# Altium project stm32f405rgt.PrjPcb
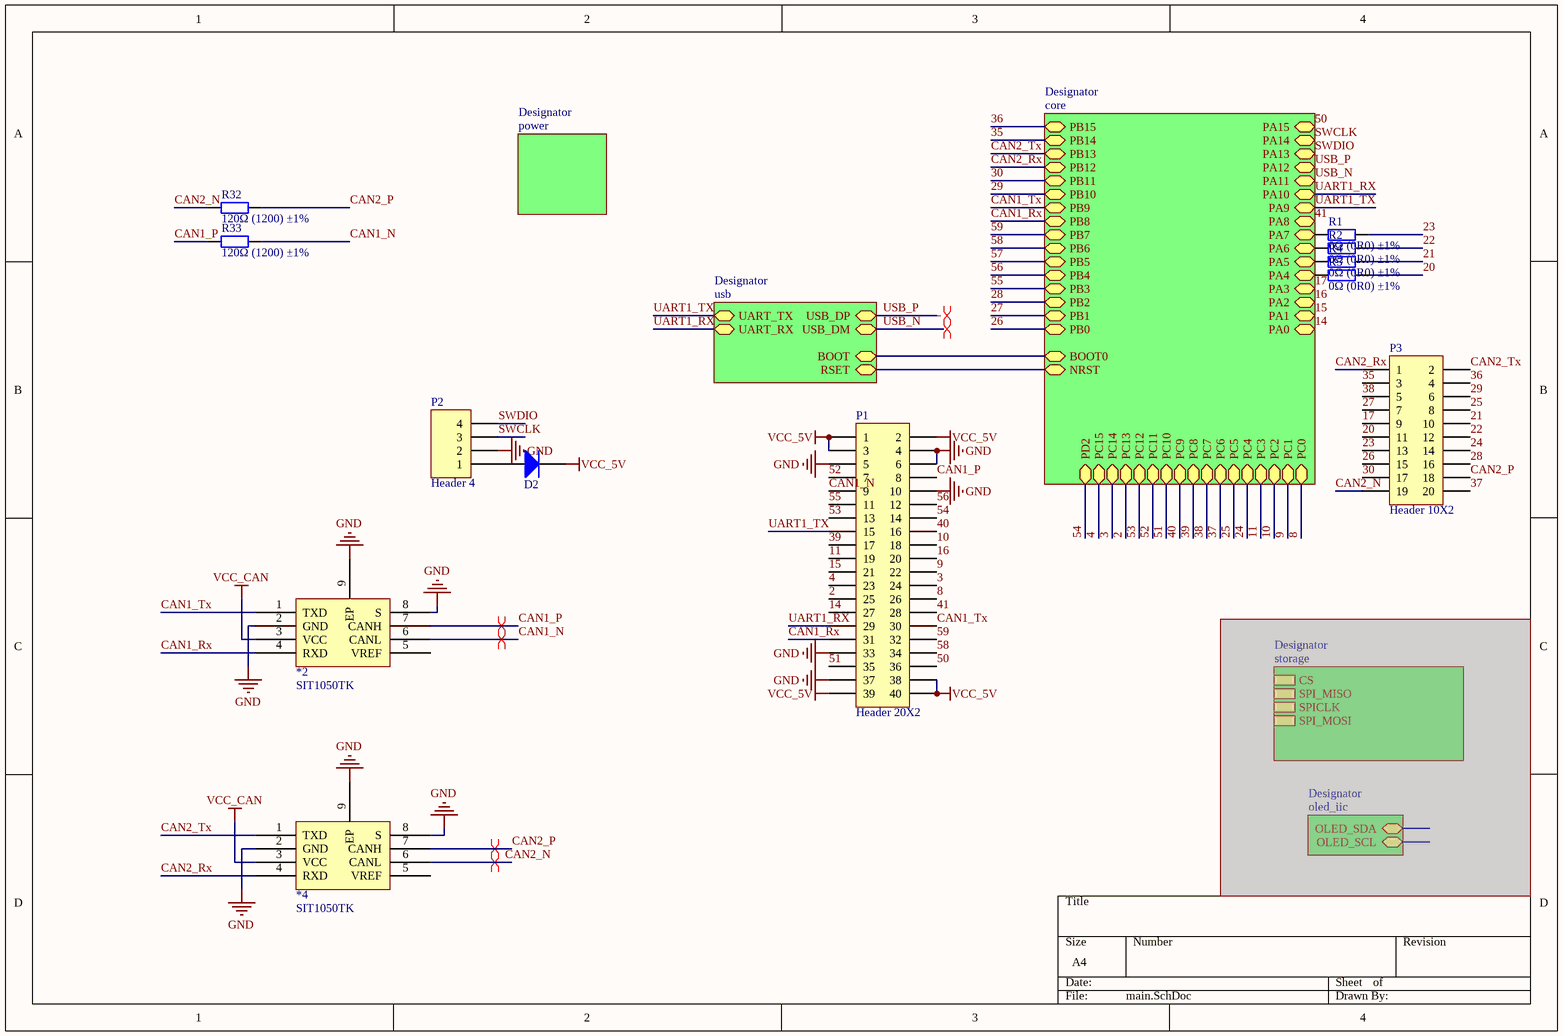
[diagram p0: main.SchDoc]
4 sheets, 89 parts. Net scope: hierarchical (ports join the sheet entries above them; power ports are global).
Board file: PCB1.PcbDoc
Sheets:
  main.SchDoc
    Designator = core.SchDoc
    Designator = usb.SchDoc
    Designator = power.SchDoc

## Sheet main.SchDoc
size A4; SheetNumber: 1; SheetTotal: 4

### Parts
(Parts that share a designator on the sheet are numbered #1, #2 ... from top to bottom, then left to right.)
*2  SIT1050TK  [DFN3x3-8]
*4  SIT1050TK  [DFN3x3-8]
D2#1  二极管-5819W  [SOD-323]  (value not drawn)
P1  Header 20X2  [HEADER_0.8mm_2x20P_G]
P2  Header 4  [HDR1X4]
P3  Header 10X2  [HEAER_0.8mm_2x10P_M]
R1  0Ω (0R0) ±1%  [LC-0402_R]
R2#1  0Ω (0R0) ±1%  [LC-0402_R]
R4#1  0Ω (0R0) ±1%  [LC-0402_R]
R5  0Ω (0R0) ±1%  [LC-0402_R]
R32#1  120Ω (1200) ±1%  [LC-0402_R]
R33#1  120Ω (1200) ±1%  [LC-0402_R]

### Sub-sheets
Designator = core: PB15 (bidir), PB14 (bidir), PB13 (bidir), PB12 (bidir), PB11 (bidir), PB10 (bidir), PB9 (bidir), PB8 (bidir), PB7 (bidir), PB6 (bidir), PB5 (bidir), PB4 (bidir), PB3 (bidir), PB2 (bidir), PB1 (bidir), PB0 (bidir), PA15 (bidir), PA14 (bidir), PA13 (bidir), PA12 (bidir), PA11 (bidir), PA10 (bidir), PA9 (bidir), PA8 (bidir), PA7 (bidir), PA6 (bidir), PA5 (bidir), PA4 (bidir), PA3 (bidir), PA2 (bidir), PA1 (bidir), PA0 (bidir), PD2 (bidir), PC15 (bidir), PC14 (bidir), PC13 (bidir), PC12 (bidir), PC11 (bidir), PC10 (bidir), PC9 (bidir), PC8 (bidir), PC7 (bidir), PC6 (bidir), PC5 (bidir), PC4 (bidir), PC3 (bidir), PC2 (bidir), PC1 (bidir), PC0 (bidir), BOOT0 (bidir), NRST (bidir)
Designator = storage (masked out) (file not in this document): CS, SPI_MISO, SPICLK, SPI_MOSI
Designator = usb: UART_TX (bidir), UART_RX (bidir), USB_DP (bidir), USB_DM (bidir), BOOT (bidir), RSET (bidir)
Designator = power: no entries
Designator = oled_iic (masked out) (file not in this document): OLED_SDA (bidir), OLED_SCL (bidir)

### Nets
GND: *2.2(GND) *2.8(S) *2.9(EP) *4.2(GND) *4.8(S) *4.9(EP) P1.4 P1.5 P1.6 P1.10 P1.33 P1.37 P2.2
VCC_5V: D2#1.2(K) P1.1 P1.2 P1.3 P1.38 P1.39 P1.40
VCC_CAN: *2.3(VCC) *4.3(VCC)
2: P1.25 ; sheet Designator/PC13
3: P1.24 ; sheet Designator/PC14
4: P1.23 ; sheet Designator/PC15
8: P1.26 ; sheet Designator/PC0
9: P1.22 ; sheet Designator/PC1
10: P1.18 ; sheet Designator/PC2
11: P1.19 ; sheet Designator/PC3
14: P1.27 ; sheet Designator/PA0
15: P1.21 ; sheet Designator/PA1
16: P1.20 ; sheet Designator/PA2
17: P3.9 ; sheet Designator/PA3
20: P3.11 R5.2
21: P3.10 R4#1.2
22: P3.12 R2#1.2
23: P3.13 R1.2
24: P3.14 ; sheet Designator/PC4
25: P3.8 ; sheet Designator/PC5
26: P3.15 ; sheet Designator/PB0
27: P3.7 ; sheet Designator/PB1
28: P3.16 ; sheet Designator/PB2
29: P3.6 ; sheet Designator/PB10
30: P3.17 ; sheet Designator/PB11
35: P3.3 ; sheet Designator/PB14
36: P3.4 ; sheet Designator/PB15
37: P3.20 ; sheet Designator/PC6
38: P3.5 ; sheet Designator/PC7
39: P1.17 ; sheet Designator/PC8
40: P1.16 ; sheet Designator/PC9
41: P1.28 ; sheet Designator/PA8
50: P1.36 ; sheet Designator/PA15
51: P1.35 ; sheet Designator/PC10
52: P1.7 ; sheet Designator/PC11
53: P1.13 ; sheet Designator/PC12
54: P1.14 ; sheet Designator/PD2
55: P1.11 ; sheet Designator/PB3
56: P1.12 ; sheet Designator/PB4
58: P1.34 ; sheet Designator/PB6
59: P1.32 ; sheet Designator/PB7
BOOT0: sheet Designator/BOOT0, sheet Designator/BOOT
CAN1_N: *2.6(CANL) P1.9 R33#1.2
CAN1_P: *2.7(CANH) P1.8 R33#1.1
CAN1_Rx: *2.4(RXD) P1.31 ; sheet Designator/PB8
CAN1_Tx: *2.1(TXD) P1.30 ; sheet Designator/PB9
CAN2_N: *4.6(CANL) P3.19 R32#1.1
CAN2_P: *4.7(CANH) P3.18 R32#1.2
CAN2_Rx: *4.4(RXD) P3.1 ; sheet Designator/PB12
CAN2_Tx: *4.1(TXD) P3.2 ; sheet Designator/PB13
SPI_CS: R5.1 ; sheet Designator/PA4
SPI_MISO: R2#1.1 ; sheet Designator/PA6
SPI_MOSI: R1.1 ; sheet Designator/PA7
SPI_SCLK: R4#1.1 ; sheet Designator/PA5
SWCLK: P2.3 ; sheet Designator/PA14
SWDIO: P2.4 ; sheet Designator/PA13
UART1_RX: P1.29 ; sheet Designator/PA10, sheet Designator/UART_RX
UART1_TX: P1.15 ; sheet Designator/PA9, sheet Designator/UART_TX
USB_N: sheet Designator/PA11, sheet Designator/USB_DM
USB_P: sheet Designator/PA12, sheet Designator/USB_DP
Net*_4: sheet Designator/NRST, sheet Designator/RSET
NetD2#1_1: D2#1.1(A) P2.1

Not connected (* = marked no-connect by the designer): *2 5(VREF); *4 5(VREF)

### Layout directives
differential pair: CAN1_N, CAN1_P, CAN2_N, CAN2_P, USB_N, USB_P

### Library data of the parts
D2#1 = 二极管-5819W: 40V
P1 = Header 20X2: Header, 20-Pin, Dual row; LatestRevisionDate: 17-Jul-2002; LatestRevisionNote: Re-released for DXP Platform.; Publisher: Altium Limited
P2 = Header 4: Header, 4-Pin; LatestRevisionDate: 17-Jul-2002; LatestRevisionNote: Re-released for DXP Platform.; Publisher: Altium Limited
P3 = Header 10X2: Header, 10-Pin, Dual row; LatestRevisionDate: 17-Jul-2002; LatestRevisionNote: Re-released for DXP Platform.; Publisher: Altium Limited
R1 R2#1 R4#1 R5 = 0402 0Ω (0R0) 1%: 贴片电阻; ComponentLink1Description: 供应商链接; ComponentLink1URL: http://www.szlcsc.com/product/details_17853.html; Package: 0402; Supplier: LC; SuppliersPartNumber: C17168
R32#1 R33#1 = 0402 120Ω (1200) 1%: 贴片电阻; ComponentLink1Description: 供应商链接; ComponentLink1URL: http://www.szlcsc.com/product/details_25822.html; Package: 0402; Supplier: LC; SuppliersPartNumber: C25079

## Sheet core.SchDoc
size A4; SheetNumber: 3; SheetTotal: 5
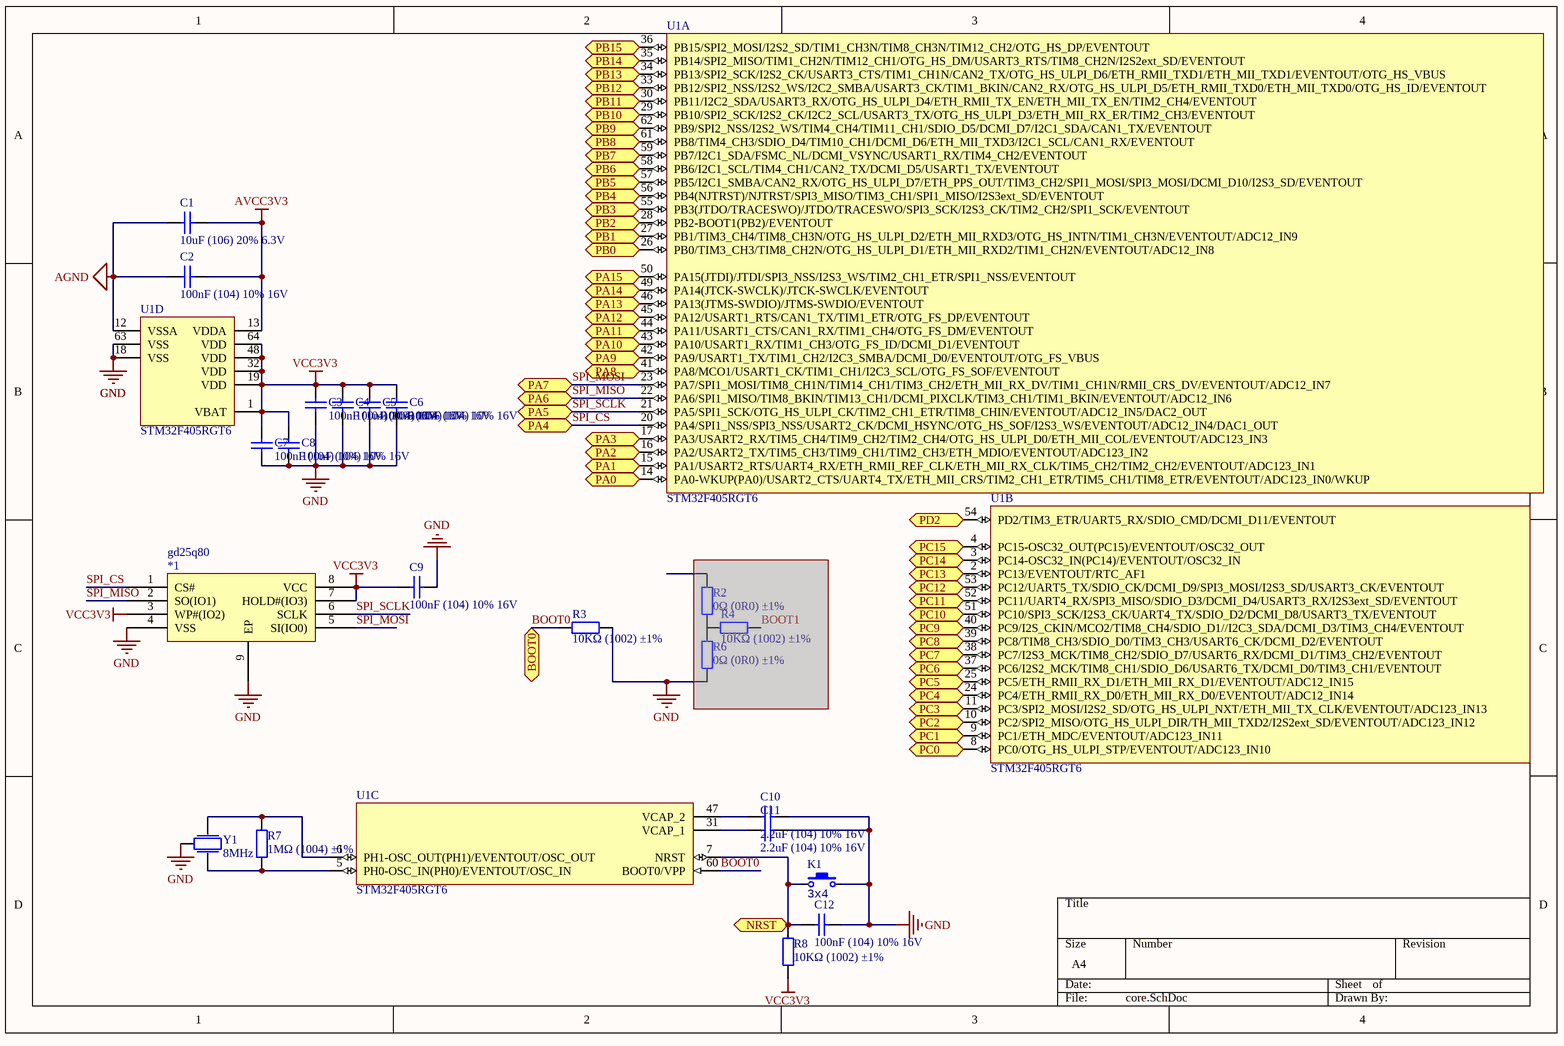
[diagram p1: core.SchDoc]

### Parts
(Parts that share a designator on the sheet are numbered #1, #2 ... from top to bottom, then left to right.)
*1  gd25q80  [USON-8]
C1  10uF (106) 20% 6.3V  [LC-0402_C]
C2  100nF (104) 10% 16V  [LC-0402_C]
C3  100nF (104) 10% 16V  [LC-0402_C]
C4  100nF (104) 10% 16V  [LC-0402_C]
C5  100nF (104) 10% 16V  [LC-0402_C]
C6  100nF (104) 10% 16V  [LC-0402_C]
C7  100nF (104) 10% 16V  [LC-0402_C]
C8  100nF (104) 10% 16V  [LC-0402_C]
C9  100nF (104) 10% 16V  [LC-0402_C]
C10  2.2uF (104) 10% 16V  [LC-0402_C]
C11  2.2uF (104) 10% 16V  [LC-0402_C]
C12  100nF (104) 10% 16V  [LC-0402_C]
K1  value 3x4  [ButtonTACT_3x4x2_180]  (hidden comment: TACT 2P)
R2#2  0Ω (0R0) ±1%  [LC-0402_R]  (masked out: inside a compile mask, not in the netlist)
R3  10KΩ (1002) ±1%  [LC-0402_R]
R4#2  10KΩ (1002) ±1%  [LC-0402_R]  (masked out: inside a compile mask, not in the netlist)
R6#1  0Ω (0R0) ±1%  [LC-0402_R]  (masked out: inside a compile mask, not in the netlist)
R7  1MΩ (1004) ±1%  [LC-0402_R]
R8  10KΩ (1002) ±1%  [LC-0402_R]
U1  STM32F405RGT6  [LC-LQFP-64_10x10x05P]  (parts A,B,C,D of 4)
Y1  8MHz  [晶振-3P]

### Ports
BOOT0 (bidir), NRST (bidir), PA0 (bidir), PA1 (bidir), PA2 (bidir), PA3 (bidir), PA4 (bidir), PA5 (bidir), PA6 (bidir), PA7 (bidir), PA8 (bidir), PA9 (bidir), PA10 (bidir), PA11 (bidir), PA12 (bidir), PA13 (bidir), PA14 (bidir), PA15 (bidir), PB0 (bidir), PB1 (bidir), PB2 (bidir), PB3 (bidir), PB4 (bidir), PB5 (bidir), PB6 (bidir), PB7 (bidir), PB8 (bidir), PB9 (bidir), PB10 (bidir), PB11 (bidir), PB12 (bidir), PB13 (bidir), PB14 (bidir), PB15 (bidir), PC0 (bidir), PC1 (bidir), PC2 (bidir), PC3 (bidir), PC4 (bidir), PC5 (bidir), PC6 (bidir), PC7 (bidir), PC8 (bidir), PC9 (bidir), PC10 (bidir), PC11 (bidir), PC12 (bidir), PC13 (bidir), PC14 (bidir), PC15 (bidir), PD2 (bidir)

### Nets
AGND: C1.1 C2.2 U1.12(VSSA)
AVCC3V3: C1.2 C2.1 U1.13(VDDA)
GND: *1.4(VSS) *1.9(EP) C3.1 C4.1 C5.1 C6.1 C7.1 C8.1 C9.1 C10.1 C11.1 C12.1 K1.2 R3.1 U1.18(VSS) U1.63(VSS) Y1.2
VCC3V3: *1.3(WP#(IO2)) *1.7(HOLD#(IO3)) *1.8(VCC) C3.2 C4.2 C5.2 C6.2 C7.2 C8.2 C9.2 R8.1 U1.1(VBAT) U1.19(VDD) U1.32(VDD) U1.48(VDD) U1.64(VDD)
2: U1.2(PC13/EVENTOUT/RTC_AF1) ; port PC13
3: U1.3(PC14-OSC32_IN(PC14)/EVENTOUT/OSC32_IN) ; port PC14
4: U1.4(PC15-OSC32_OUT(PC15)/EVENTOUT/OSC32_OUT) ; port PC15
8: U1.8(PC0/OTG_HS_ULPI_STP/EVENTOUT/ADC123_IN10) ; port PC0
9: U1.9(PC1/ETH_MDC/EVENTOUT/ADC123_IN11) ; port PC1
10: U1.10(PC2/SPI2_MISO/OTG_HS_ULPI_DIR/TH_MII_TXD2/I2S2ext_SD/EVENTOUT/ADC123_IN12) ; port PC2
11: U1.11(PC3/SPI2_MOSI/I2S2_SD/OTG_HS_ULPI_NXT/ETH_MII_TX_CLK/EVENTOUT/ADC123_IN13) ; port PC3
14: U1.14(PA0-WKUP(PA0)/USART2_CTS/UART4_TX/ETH_MII_CRS/TIM2_CH1_ETR/TIM5_CH1/TIM8_ETR/EVENTOUT/ADC123_IN0/WKUP) ; port PA0
15: U1.15(PA1/USART2_RTS/UART4_RX/ETH_RMII_REF_CLK/ETH_MII_RX_CLK/TIM5_CH2/TIM2_CH2/EVENTOUT/ADC123_IN1) ; port PA1
16: U1.16(PA2/USART2_TX/TIM5_CH3/TIM9_CH1/TIM2_CH3/ETH_MDIO/EVENTOUT/ADC123_IN2) ; port PA2
17: U1.17(PA3/USART2_RX/TIM5_CH4/TIM9_CH2/TIM2_CH4/OTG_HS_ULPI_D0/ETH_MII_COL/EVENTOUT/ADC123_IN3) ; port PA3
24: U1.24(PC4/ETH_RMII_RX_D0/ETH_MII_RX_D0/EVENTOUT/ADC12_IN14) ; port PC4
25: U1.25(PC5/ETH_RMII_RX_D1/ETH_MII_RX_D1/EVENTOUT/ADC12_IN15) ; port PC5
26: U1.26(PB0/TIM3_CH3/TIM8_CH2N/OTG_HS_ULPI_D1/ETH_MII_RXD2/TIM1_CH2N/EVENTOUT/ADC12_IN8) ; port PB0
27: U1.27(PB1/TIM3_CH4/TIM8_CH3N/OTG_HS_ULPI_D2/ETH_MII_RXD3/OTG_HS_INTN/TIM1_CH3N/EVENTOUT/ADC12_IN9) ; port PB1
28: U1.28(PB2-BOOT1(PB2)/EVENTOUT) ; port PB2
29: U1.29(PB10/SPI2_SCK/I2S2_CK/I2C2_SCL/USART3_TX/OTG_HS_ULPI_D3/ETH_MII_RX_ER/TIM2_CH3/EVENTOUT) ; port PB10
30: U1.30(PB11/I2C2_SDA/USART3_RX/OTG_HS_ULPI_D4/ETH_RMII_TX_EN/ETH_MII_TX_EN/TIM2_CH4/EVENTOUT) ; port PB11
35: U1.35(PB14/SPI2_MISO/TIM1_CH2N/TIM12_CH1/OTG_HS_DM/USART3_RTS/TIM8_CH2N/I2S2ext_SD/EVENTOUT) ; port PB14
36: U1.36(PB15/SPI2_MOSI/I2S2_SD/TIM1_CH3N/TIM8_CH3N/TIM12_CH2/OTG_HS_DP/EVENTOUT) ; port PB15
37: U1.37(PC6/I2S2_MCK/TIM8_CH1/SDIO_D6/USART6_TX/DCMI_D0/TIM3_CH1/EVENTOUT) ; port PC6
38: U1.38(PC7/I2S3_MCK/TIM8_CH2/SDIO_D7/USART6_RX/DCMI_D1/TIM3_CH2/EVENTOUT) ; port PC7
39: U1.39(PC8/TIM8_CH3/SDIO_D0/TIM3_CH3/USART6_CK/DCMI_D2/EVENTOUT) ; port PC8
40: U1.40(PC9/I2S_CKIN/MCO2/TIM8_CH4/SDIO_D1//I2C3_SDA/DCMI_D3/TIM3_CH4/EVENTOUT) ; port PC9
41: U1.41(PA8/MCO1/USART1_CK/TIM1_CH1/I2C3_SCL/OTG_FS_SOF/EVENTOUT) ; port PA8
50: U1.50(PA15(JTDI)/JTDI/SPI3_NSS/I2S3_WS/TIM2_CH1_ETR/SPI1_NSS/EVENTOUT) ; port PA15
51: U1.51(PC10/SPI3_SCK/I2S3_CK/UART4_TX/SDIO_D2/DCMI_D8/USART3_TX/EVENTOUT) ; port PC10
52: U1.52(PC11/UART4_RX/SPI3_MISO/SDIO_D3/DCMI_D4/USART3_RX/I2S3ext_SD/EVENTOUT) ; port PC11
53: U1.53(PC12/UART5_TX/SDIO_CK/DCMI_D9/SPI3_MOSI/I2S3_SD/USART3_CK/EVENTOUT) ; port PC12
54: U1.54(PD2/TIM3_ETR/UART5_RX/SDIO_CMD/DCMI_D11/EVENTOUT) ; port PD2
55: U1.55(PB3(JTDO/TRACESWO)/JTDO/TRACESWO/SPI3_SCK/I2S3_CK/TIM2_CH2/SPI1_SCK/EVENTOUT) ; port PB3
56: U1.56(PB4(NJTRST)/NJTRST/SPI3_MISO/TIM3_CH1/SPI1_MISO/I2S3ext_SD/EVENTOUT) ; port PB4
57: U1.57(PB5/I2C1_SMBA/CAN2_RX/OTG_HS_ULPI_D7/ETH_PPS_OUT/TIM3_CH2/SPI1_MOSI/SPI3_MOSI/DCMI_D10/I2S3_SD/EVENTOUT) ; port PB5
58: U1.58(PB6/I2C1_SCL/TIM4_CH1/CAN2_TX/DCMI_D5/USART1_TX/EVENTOUT) ; port PB6
59: U1.59(PB7/I2C1_SDA/FSMC_NL/DCMI_VSYNC/USART1_RX/TIM4_CH2/EVENTOUT) ; port PB7
BOOT0: R3.2 U1.60(BOOT0/VPP) ; port BOOT0
CAN1_Rx: U1.61(PB8/TIM4_CH3/SDIO_D4/TIM10_CH1/DCMI_D6/ETH_MII_TXD3/I2C1_SCL/CAN1_RX/EVENTOUT) ; port PB8
CAN1_Tx: U1.62(PB9/SPI2_NSS/I2S2_WS/TIM4_CH4/TIM11_CH1/SDIO_D5/DCMI_D7/I2C1_SDA/CAN1_TX/EVENTOUT) ; port PB9
CAN2_Rx: U1.33(PB12/SPI2_NSS/I2S2_WS/I2C2_SMBA/USART3_CK/TIM1_BKIN/CAN2_RX/OTG_HS_ULPI_D5/ETH_RMII_TXD0/ETH_MII_TXD0/OTG_HS_ID/EVENTOUT) ; port PB12
CAN2_Tx: U1.34(PB13/SPI2_SCK/I2S2_CK/USART3_CTS/TIM1_CH1N/CAN2_TX/OTG_HS_ULPI_D6/ETH_RMII_TXD1/ETH_MII_TXD1/EVENTOUT/OTG_HS_VBUS) ; port PB13
SPI_CS: *1.1(CS#) U1.20(PA4/SPI1_NSS/SPI3_NSS/USART2_CK/DCMI_HSYNC/OTG_HS_SOF/I2S3_WS/EVENTOUT/ADC12_IN4/DAC1_OUT) ; port PA4
SPI_MISO: *1.2(SO(IO1)) U1.22(PA6/SPI1_MISO/TIM8_BKIN/TIM13_CH1/DCMI_PIXCLK/TIM3_CH1/TIM1_BKIN/EVENTOUT/ADC12_IN6) ; port PA6
SPI_MOSI: *1.5(SI(IO0)) U1.23(PA7/SPI1_MOSI/TIM8_CH1N/TIM14_CH1/TIM3_CH2/ETH_MII_RX_DV/TIM1_CH1N/RMII_CRS_DV/EVENTOUT/ADC12_IN7) ; port PA7
SPI_SCLK: *1.6(SCLK) U1.21(PA5/SPI1_SCK/OTG_HS_ULPI_CK/TIM2_CH1_ETR/TIM8_CHIN/EVENTOUT/ADC12_IN5/DAC2_OUT) ; port PA5
SWCLK: U1.49(PA14(JTCK-SWCLK)/JTCK-SWCLK/EVENTOUT) ; port PA14
SWDIO: U1.46(PA13(JTMS-SWDIO)/JTMS-SWDIO/EVENTOUT) ; port PA13
UART1_RX: U1.43(PA10/USART1_RX/TIM1_CH3/OTG_FS_ID/DCMI_D1/EVENTOUT) ; port PA10
UART1_TX: U1.42(PA9/USART1_TX/TIM1_CH2/I2C3_SMBA/DCMI_D0/EVENTOUT/OTG_FS_VBUS) ; port PA9
USB_N: U1.44(PA11/USART1_CTS/CAN1_RX/TIM1_CH4/OTG_FS_DM/EVENTOUT) ; port PA11
USB_P: U1.45(PA12/USART1_RTS/CAN1_TX/TIM1_ETR/OTG_FS_DP/EVENTOUT) ; port PA12
Net*_4: C12.2 K1.1 R8.2 U1.7(NRST) ; port NRST
NetC10_2: C10.2 U1.47(VCAP_2)
NetC11_2: C11.2 U1.31(VCAP_1)
NetR7_1: R7.1 U1.5(PH0-OSC_IN(PH0)/EVENTOUT/OSC_IN) Y1.1
NetR7_2: R7.2 U1.6(PH1-OSC_OUT(PH1)/EVENTOUT/OSC_OUT) Y1.3

### Library data of the parts
C1 = 0402 10uF (106) 20% 6.3V: 贴片电容; ComponentLink1Description: 供应商链接; ComponentLink1URL: http://www.szlcsc.com/product/details_16204.html; Package: 0402; Supplier: LC; SuppliersPartNumber: C15525
C2-C12 = 0402 100nF (104) 10% 16V: 贴片电容; ComponentLink1Description: 供应商链接; ComponentLink1URL: http://www.szlcsc.com/product/details_1877.html; Package: 0402; Supplier: LC; SuppliersPartNumber: C1525
K1 = ButtonTACT_3x4x2_180: Button; type: TACT 2P
R2#2 R6#1 = 0402 0Ω (0R0) 1%: 贴片电阻; ComponentLink1Description: 供应商链接; ComponentLink1URL: http://www.szlcsc.com/product/details_17853.html; Package: 0402; Supplier: LC; SuppliersPartNumber: C17168
R3 R4#2 R8 = 0402 10KΩ (1002) 1%: 贴片电阻; ComponentLink1Description: 供应商链接; ComponentLink1URL: http://www.szlcsc.com/product/details_26487.html; Package: 0402; Supplier: LC; SuppliersPartNumber: C25744
R7 = 0402 1MΩ (1004) 1%: 贴片电阻; ComponentLink1Description: 供应商链接; ComponentLink1URL: http://www.szlcsc.com/product/details_26826.html; Package: 0402; Supplier: LC; SuppliersPartNumber: C26083
U1 = STM32F405RGT6: ARM; ComponentLink1Description: 供应商链接; ComponentLink1URL: http://www.szlcsc.com/product/details_16424.html; Package: LQFP-64_10x10x05P; Supplier: LC; SuppliersPartNumber: C15742
Y1 = 晶振-3Pin: 村田贴片

## Sheet usb.SchDoc
size A4; SheetNumber: 5; SheetTotal: 5
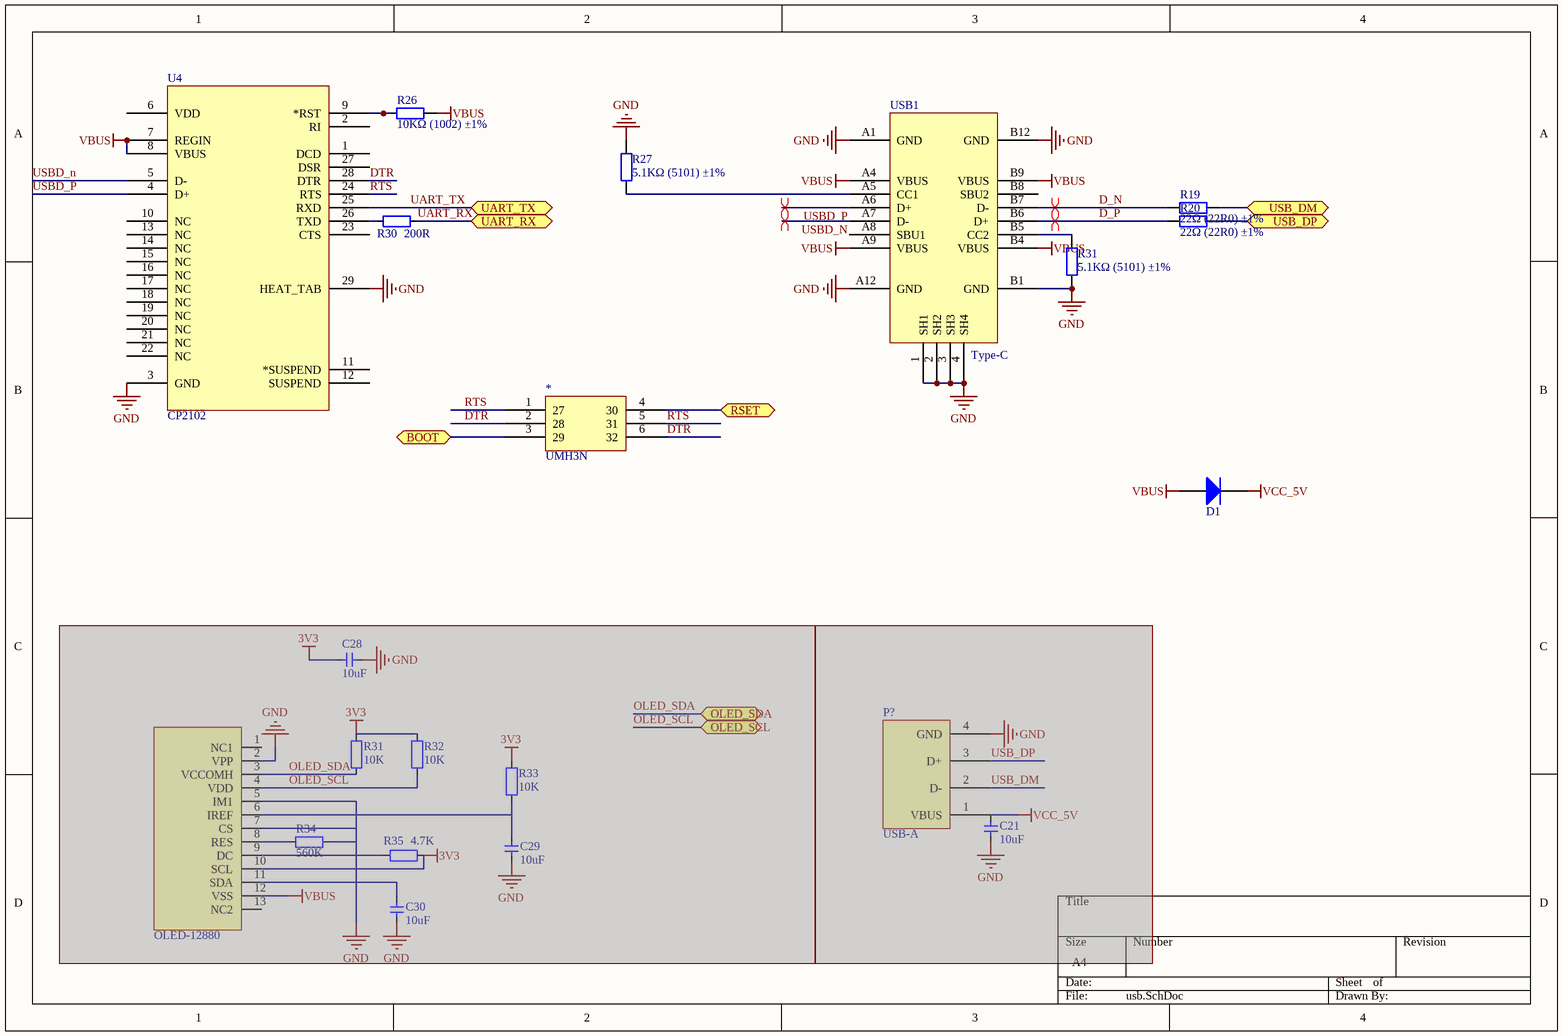
[diagram p2: usb.SchDoc]

### Parts
(Parts that share a designator on the sheet are numbered #1, #2 ... from top to bottom, then left to right.)
2  OLED-12880  [OLED-12880]  (masked out: inside a compile mask, not in the netlist)
*  UMH3N  [SC-70-6(SOT-363)]
C21#1  10uF  [CAP_0402]  (masked out: inside a compile mask, not in the netlist)
C28  10uF  [CAP_0402]  (masked out: inside a compile mask, not in the netlist)
C29  10uF  [CAP_0402]  (masked out: inside a compile mask, not in the netlist)
C30  10uF  [CAP_0402]  (masked out: inside a compile mask, not in the netlist)
D1#1  二极管-5819W  [SOD-323]  (value not drawn)
P?  USB-A  [USB-Short]  (masked out: inside a compile mask, not in the netlist)
R19  22Ω (22R0) ±1%  [LC-0402_R]
R20#1  22Ω (22R0) ±1%  [LC-0402_R]
R26  10KΩ (1002) ±1%  [LC-0402_R]
R27  5.1KΩ (5101) ±1%  [LC-0402_R]
R30  200R  [RES_0402]
R31#1  5.1KΩ (5101) ±1%  [LC-0402_R]
R31#2  10K  [RES_0402]  (masked out: inside a compile mask, not in the netlist)
R32#2  10K  [RES_0402]  (masked out: inside a compile mask, not in the netlist)
R33#2  10K  [RES_0402]  (masked out: inside a compile mask, not in the netlist)
R34  560K  [RES_0402]  (masked out: inside a compile mask, not in the netlist)
R35  4.7K  [RES_0402]  (masked out: inside a compile mask, not in the netlist)
U4  CP2102  [QFN-28]
USB1  Type-C  [Type-C-TOP]

### Ports
BOOT (bidir), OLED_SCL (bidir), OLED_SDA (bidir), RSET (bidir), UART_RX (bidir), UART_TX (bidir), USB_DM (bidir), USB_DP (bidir)

### Nets
GND: R27.1 R31#1.1 U4.3(GND) U4.29(HEAT_TAB) USB1.1(SH1) USB1.2(SH2) USB1.3(SH3) USB1.4(SH4) USB1.A1(GND) USB1.A12(GND) USB1.B1(GND) USB1.B12(GND)
VBUS: D1#1.1(A) R26.2 U4.7(REGIN) U4.8(VBUS) USB1.A4(VBUS) USB1.A9(VBUS) USB1.B4(VBUS) USB1.B9(VBUS)
VCC_5V: D1#1.2(K)
BOOT0: *.3(29) ; port BOOT
D_N: R19.2 USB1.B7(D-)
D_P: R20#1.2 USB1.B6(D+)
DTR: *.2(28) *.6(32) U4.28(DTR)
RTS: *.1(27) *.5(31) U4.24(RTS)
UART_RX: R30.1 ; port UART_RX  [project net UART1_RX]
UART_TX: U4.25(RXD) ; port UART_TX  [project net UART1_TX]
USB_N: R19.1 ; port USB_DM
USB_P: R20#1.1 ; port USB_DP
USBD_n: U4.5(D-) USB1.A7(D-)
USBD_P: U4.4(D+) USB1.A6(D+)
Net*_4: *.4(30) ; port RSET
NetR26_1: R26.1 U4.9(*RST)
NetR27_2: R27.2 USB1.A5(CC1)
NetR30_2: R30.2 U4.26(TXD)
NetR31#1_2: R31#1.2 USB1.B5(CC2)

Not connected (* = marked no-connect by the designer): U4 1(DCD) 2(RI) 6(VDD) 10(NC) 11(*SUSPEND) 12(SUSPEND) 13(NC) 14(NC) 15(NC) 16(NC) 17(NC) 18(NC) 19(NC) 20(NC) 21(NC) 22(NC) 23(CTS) 27(DSR); USB1 A8(SBU1) B8(SBU2)

### Layout directives
differential pair: D_N, D_P, USBD_n, USBD_P

### Library data of the parts
C21#1 C28-C30 = 电容-0402: Capacitor; Value: 0.1u
D1#1 = 二极管-5819W: 40V
R19 R20#1 = 0402 22Ω (22R0) 1%: 贴片电阻; ComponentLink1Description: 供应商链接; ComponentLink1URL: http://www.szlcsc.com/product/details_25835.html; Package: 0402; Supplier: LC; SuppliersPartNumber: C25092
R26 = 0402 10KΩ (1002) 1%: 贴片电阻; ComponentLink1Description: 供应商链接; ComponentLink1URL: http://www.szlcsc.com/product/details_26487.html; Package: 0402; Supplier: LC; SuppliersPartNumber: C25744
R27 R31#1 = 0402 5.1KΩ (5101) 1%: 贴片电阻; ComponentLink1Description: 供应商链接; ComponentLink1URL: http://www.szlcsc.com/product/details_26648.html; Package: 0402; Supplier: LC; SuppliersPartNumber: C25905
R30 R31#2 R32#2 R33#2 R34 R35 = 电阻-0402: Resistor; Value: 22R
U4 = CP2102: USB转TTL; PART DESC: SINGLE-CHIP USB TO UART BRIDGE, QFN28, RoHS.; MFG #1: SILICON LABS; PART NUMBER: CP2102; Value: Value; RefDes: RefDes; Type: DEV
USB1 = USB-Type-C-TOP

## Sheet power.SchDoc
size A4; SheetNumber: 4; SheetTotal: 5
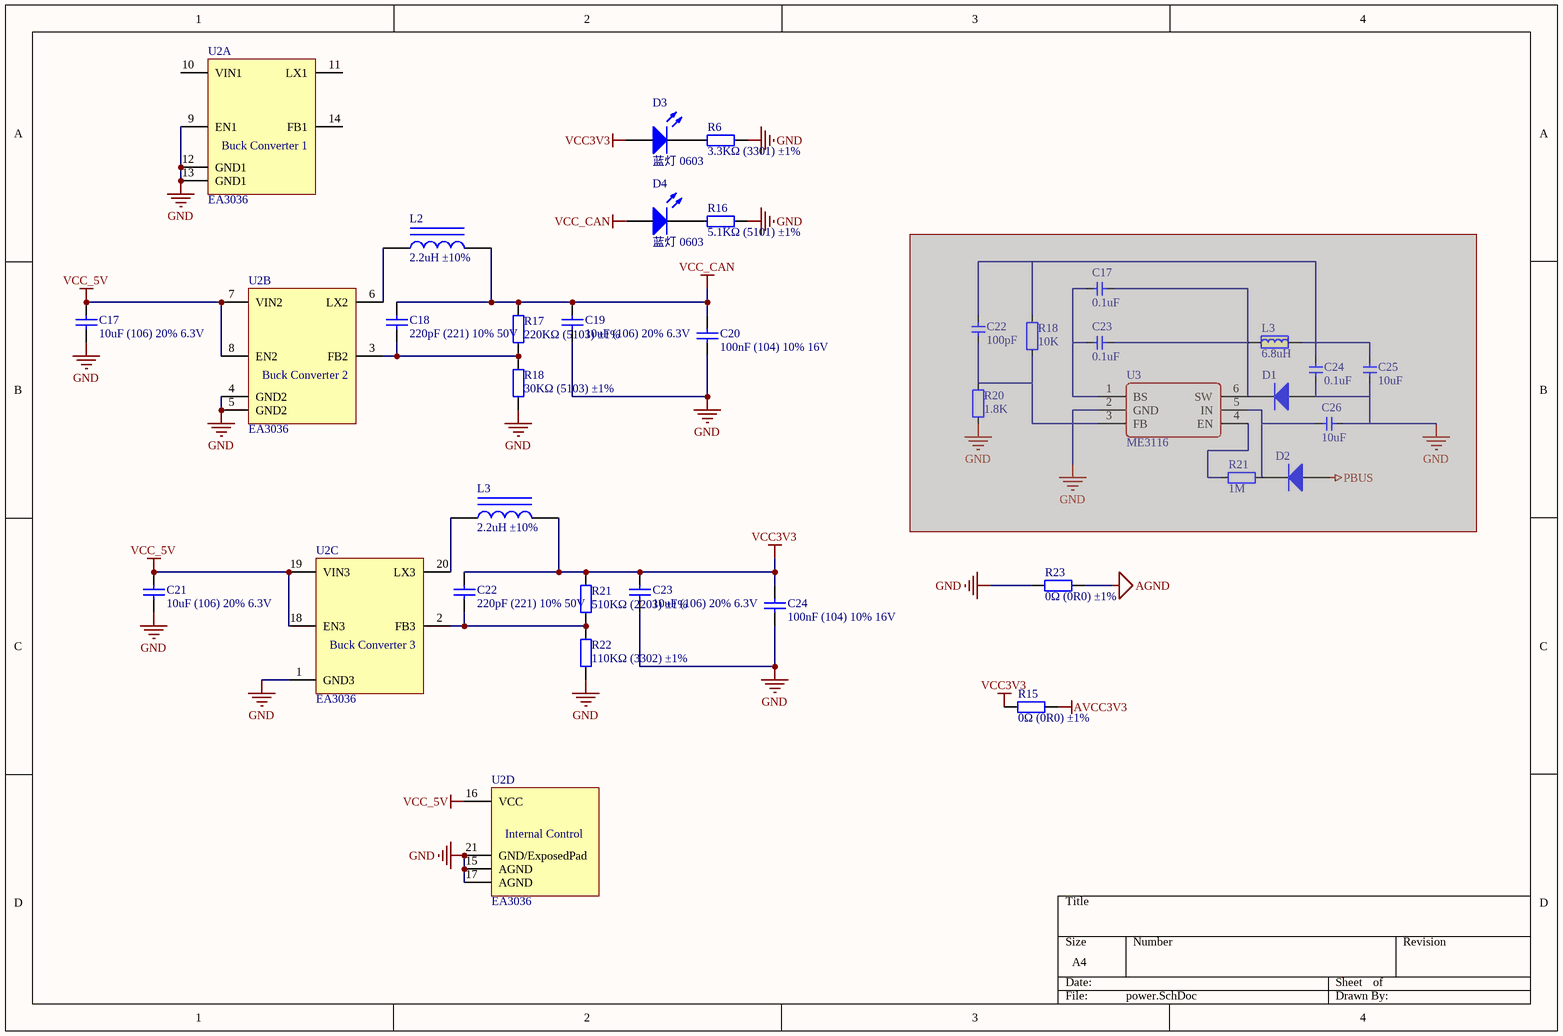
[diagram p3: power.SchDoc]

### Parts
(Parts that share a designator on the sheet are numbered #1, #2 ... from top to bottom, then left to right.)
C17#1  0.1uF  [CAP_0402]  (masked out: inside a compile mask, not in the netlist)
C17#2  10uF (106) 20% 6.3V  [LC-0402_C]
C18  220pF (221) 10% 50V  [LC-0402_C]
C19  10uF (106) 20% 6.3V  [LC-0402_C]
C20  100nF (104) 10% 16V  [LC-0402_C]
C21#2  10uF (106) 20% 6.3V  [LC-0402_C]
C22#1  100pF  [CAP_0402]  (masked out: inside a compile mask, not in the netlist)
C22#2  220pF (221) 10% 50V  [LC-0402_C]
C23#1  0.1uF  [CAP_0402]  (masked out: inside a compile mask, not in the netlist)
C23#2  10uF (106) 20% 6.3V  [LC-0402_C]
C24#1  0.1uF  [CAP_0402]  (masked out: inside a compile mask, not in the netlist)
C24#2  100nF (104) 10% 16V  [LC-0402_C]
C25  10uF  [CAP_0402]  (masked out: inside a compile mask, not in the netlist)
C26  10uF  [CAP_0402]  (masked out: inside a compile mask, not in the netlist)
D1#2  二极管-5B5819WS  [SOD-323]  (value not drawn)  (masked out: inside a compile mask, not in the netlist)
D2#2  二极管-5B5819WS  [SOD-323]  (value not drawn)  (masked out: inside a compile mask, not in the netlist)
D3  蓝灯 0603  [LC-0603_LED_S1]
D4  蓝灯 0603  [LC-0603_LED_S1]
L2  2.2uH ±10%  [LC-0805_L]
L3#1  6.8uH  [IND-201612]  (masked out: inside a compile mask, not in the netlist)
L3#2  2.2uH ±10%  [LC-0805_L]
R6#2  3.3KΩ (3301) ±1%  [LC-0402_R]
R15  0Ω (0R0) ±1%  [LC-0402_R]
R16  5.1KΩ (5101) ±1%  [LC-0402_R]
R17  220KΩ (5103) ±1%  [LC-0402_R]
R18#1  10K  [RES_0402]  (masked out: inside a compile mask, not in the netlist)
R18#2  30KΩ (5103) ±1%  [LC-0402_R]
R20#2  1.8K  [RES_0402]  (masked out: inside a compile mask, not in the netlist)
R21#1  1M  [RES_0402]  (masked out: inside a compile mask, not in the netlist)
R21#2  510KΩ (2203) ±1%  [LC-0402_R]
R22  110KΩ (3302) ±1%  [LC-0402_R]
R23  0Ω (0R0) ±1%  [LC-0402_R]
U2  EA3036  [QFN-20]  (parts A,B,C,D of 4)
U3  ME3116  [SOT23-6]  (masked out: inside a compile mask, not in the netlist)

### Nets
AGND: R23.2
AVCC3V3: R15.2
GND: C17#2.1 C19.1 C20.1 C21#2.1 C23#2.1 C24#2.1 R6#2.2 R16.2 R18#2.1 R22.1 R23.1 U2.1(GND3) U2.4(GND2) U2.5(GND2) U2.9(EN1) U2.12(GND1) U2.13(GND1) U2.15(AGND) U2.17(AGND) U2.21(GND/ExposedPad)
VCC3V3: C22#2.2 C23#2.2 C24#2.2 D3.A L3#2.2 R15.1 R21#2.2
VCC_5V: C17#2.2 C21#2.2 U2.7(VIN2) U2.8(EN2) U2.16(VCC) U2.18(EN3) U2.19(VIN3)
VCC_CAN: C18.2 C19.2 C20.2 D4.A L2.2 R17.2
NetC18_1: C18.1 R17.1 R18#2.2 U2.3(FB2)
NetC22#2_1: C22#2.1 R21#2.1 R22.2 U2.2(FB3)
NetD3_K: D3.K R6#2.1
NetD4_K: D4.K R16.1
NetL2_1: L2.1 U2.6(LX2)
NetL3#2_1: L3#2.1 U2.20(LX3)

Not connected (* = marked no-connect by the designer): U2 10(VIN1) 11(LX1) 14(FB1)

### Notes on the sheet
- (in symbol EA3036, part A) Buck Converter 1
- (in symbol EA3036, part B) Buck Converter 2
- (in symbol EA3036, part C) Buck Converter 3
- (in symbol EA3036, part D) Internal Control

### Library data of the parts
C17#1 C22#1 C23#1 C24#1 C25 C26 = 电容-0402: Capacitor; Value: 0.1u
C17#2 C19 C21#2 C23#2 = 0402 10uF (106) 20% 6.3V: 贴片电容; ComponentLink1Description: 供应商链接; ComponentLink1URL: http://www.szlcsc.com/product/details_16204.html; Package: 0402; Supplier: LC; SuppliersPartNumber: C15525
C18 C22#2 = 0402 220pF (221) 10% 50V: 贴片电容; ComponentLink1Description: 供应商链接; ComponentLink1URL: http://www.szlcsc.com/product/details_1882.html; Package: 0402; Supplier: LC; SuppliersPartNumber: C1530
C20 C24#2 = 0402 100nF (104) 10% 16V: 贴片电容; ComponentLink1Description: 供应商链接; ComponentLink1URL: http://www.szlcsc.com/product/details_1877.html; Package: 0402; Supplier: LC; SuppliersPartNumber: C1525
D1#2 D2#2 = 二极管-5B5817WS: 40V
D3 D4 = 0603 蓝灯: 发光二极管; ComponentLink1Description: 供应商链接; ComponentLink1URL: http://www.szlcsc.com/product/details_73150.html; Package: 0603; Supplier: LC; SuppliersPartNumber: C72041
L2 L3#2 = 0805 2.2uH 10%: 贴片电感; ComponentLink1Description: 供应商链接; ComponentLink1URL: http://www.szlcsc.com/product/details_1395.html; Package: 0805; Supplier: LC; SuppliersPartNumber: C1043
L3#1 = 电感-201612
R6#2 = 0402 3.3KΩ (3301) 1%: 贴片电阻; ComponentLink1Description: 供应商链接; ComponentLink1URL: http://www.szlcsc.com/product/details_26633.html; Package: 0402; Supplier: LC; SuppliersPartNumber: C25890
R15 R23 = 0402 0Ω (0R0) 1%: 贴片电阻; ComponentLink1Description: 供应商链接; ComponentLink1URL: http://www.szlcsc.com/product/details_17853.html; Package: 0402; Supplier: LC; SuppliersPartNumber: C17168
R16 = 0402 5.1KΩ (5101) 1%: 贴片电阻; ComponentLink1Description: 供应商链接; ComponentLink1URL: http://www.szlcsc.com/product/details_26648.html; Package: 0402; Supplier: LC; SuppliersPartNumber: C25905
R17 R18#2 = 0402 510KΩ (5103) 1%: 贴片电阻; ComponentLink1Description: 供应商链接; ComponentLink1URL: http://www.szlcsc.com/product/details_12170.html; Package: 0402; Supplier: LC; SuppliersPartNumber: C11616
R18#1 R20#2 R21#1 = 电阻-0402: Resistor; Value: 22R
R21#2 = 0402 220KΩ (2203) 1%: 贴片电阻; ComponentLink1Description: 供应商链接; ComponentLink1URL: http://www.szlcsc.com/product/details_26510.html; Package: 0402; Supplier: LC; SuppliersPartNumber: C25767
R22 = 0402 33KΩ (3302) 1%: 贴片电阻; ComponentLink1Description: 供应商链接; ComponentLink1URL: http://www.szlcsc.com/product/details_26522.html; Package: 0402; Supplier: LC; SuppliersPartNumber: C25779
U2 = EA3036: EA3036 is a 3CH power management IC for applications powered by one Li-Ion battery or a DC 5V adapter.
U3 = ME3116: DC-DC

## Nets that join several sheets
AGND: core (C1.1 C2.2 U1.12), power (R23.2)
AVCC3V3: core (C1.2 C2.1 U1.13), power (R15.2)
GND: main (13 pins), core (17 pins), usb (12 pins), power (20 pins)
VCC3V3: core (16 pins), power (7 pins)
VCC_5V: main (7 pins), usb (D1#1.2), power (7 pins)
VCC_CAN: main (*2.3 *4.3), power (6 pins)
2: main (P1.25), core (U1.2)
3: main (P1.24), core (U1.3)
4: main (P1.23), core (U1.4)
8: main (P1.26), core (U1.8)
9: main (P1.22), core (U1.9)
10: main (P1.18), core (U1.10)
11: main (P1.19), core (U1.11)
14: main (P1.27), core (U1.14)
15: main (P1.21), core (U1.15)
16: main (P1.20), core (U1.16)
17: main (P3.9), core (U1.17)
24: main (P3.14), core (U1.24)
25: main (P3.8), core (U1.25)
26: main (P3.15), core (U1.26)
27: main (P3.7), core (U1.27)
28: main (P3.16), core (U1.28)
29: main (P3.6), core (U1.29)
30: main (P3.17), core (U1.30)
35: main (P3.3), core (U1.35)
36: main (P3.4), core (U1.36)
37: main (P3.20), core (U1.37)
38: main (P3.5), core (U1.38)
39: main (P1.17), core (U1.39)
40: main (P1.16), core (U1.40)
41: main (P1.28), core (U1.41)
50: main (P1.36), core (U1.50)
51: main (P1.35), core (U1.51)
52: main (P1.7), core (U1.52)
53: main (P1.13), core (U1.53)
54: main (P1.14), core (U1.54)
55: main (P1.11), core (U1.55)
56: main (P1.12), core (U1.56)
58: main (P1.34), core (U1.58)
59: main (P1.32), core (U1.59)
BOOT0: core (R3.2 U1.60), usb (*.3)
CAN1_Rx: main (*2.4 P1.31), core (U1.61)
CAN1_Tx: main (*2.1 P1.30), core (U1.62)
CAN2_Rx: main (*4.4 P3.1), core (U1.33)
CAN2_Tx: main (*4.1 P3.2), core (U1.34)
Net*_4: core (C12.2 K1.1 R8.2 U1.7), usb (*.4)
SPI_CS: main (R5.1), core (*1.1 U1.20)
SPI_MISO: main (R2#1.1), core (*1.2 U1.22)
SPI_MOSI: main (R1.1), core (*1.5 U1.23)
SPI_SCLK: main (R4#1.1), core (*1.6 U1.21)
SWCLK: main (P2.3), core (U1.49)
SWDIO: main (P2.4), core (U1.46)
UART1_RX: main (P1.29), core (U1.43), usb (R30.1)
UART1_TX: main (P1.15), core (U1.42), usb (U4.25)
USB_N: core (U1.44), usb (R19.1)
USB_P: core (U1.45), usb (R20#1.1)